# Altium schematic sheet IMU.SchDoc
size A4; SheetNumber: 1; SheetTotal: 2
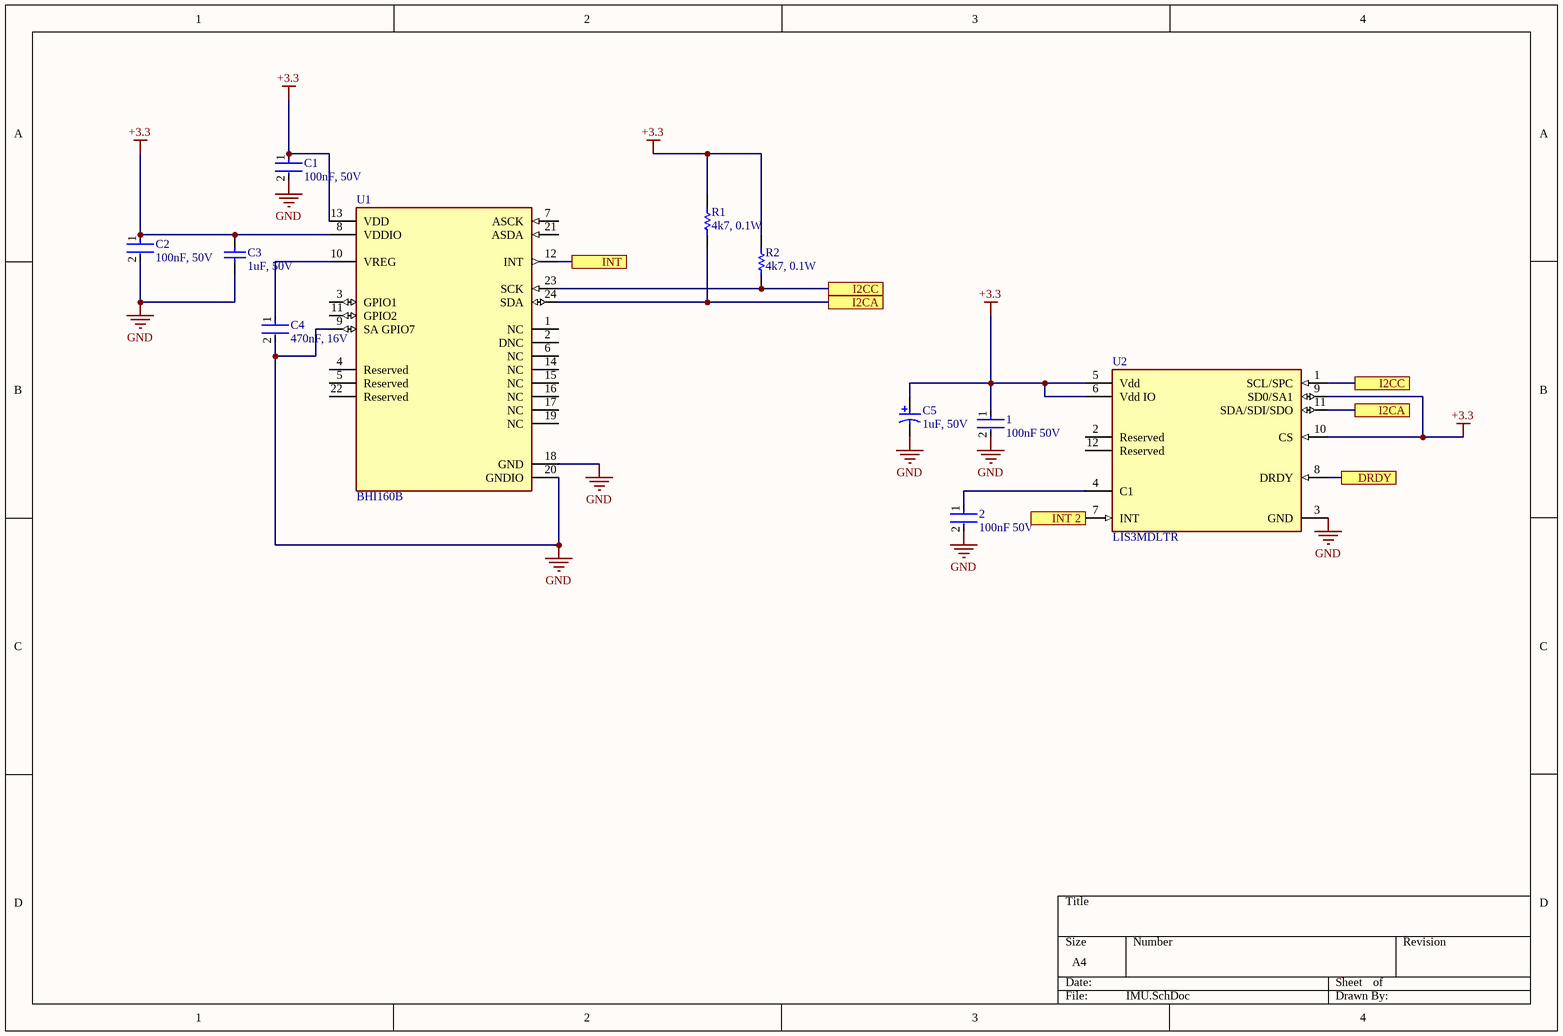
[diagram p0: IMU.SchDoc]

## Parts
1  100nF 50V  [FP-CGA3E-0_3-0_1-IPC_A]
2  100nF 50V  [FP-CGA3E-0_3-0_1-IPC_A]
C1  100nF, 50V  [FP-CGA3E-0_3-0_1-IPC_A]
C2  100nF, 50V  [FP-CGA3E-0_3-0_1-IPC_A]
C3  1uF, 50V  [CAPC1608X90X35ML10T25]
C4  470nF, 16V  [FP-C0603C-CF-MFG]
C5  1uF, 50V  [CAPPR55-200-1100X500X1200]
R1  4k7, 0.1W  [RESC1608X55X25LL10T15]
R2  4k7, 0.1W  [RESC1608X55X25LL10T15]
U1  BHI160B  [FP-BHI160B-MFG]
U2  LIS3MDLTR  [FP-VFLGA-12-8365767-MFG]

## Ports
DRDY, I2CA, I2CC, INT, INT 2

## Nets
+3.3: 1.1 C1.1 C2.1 C3.2 C5.1 R1.2 R2.2 U1.8(VDDIO) U1.13(VDD) U2.5(Vdd) U2.6(Vdd_IO) U2.9(SD0/SA1) U2.10(CS)
GND: 1.2 2.2 C1.2 C2.2 C3.1 C4.2 C5.2 U1.9(SA_GPIO7) U1.18(GND) U1.20(GNDIO) U2.3(GND)
DRDY: U2.8(DRDY) ; port DRDY
I2CA: R1.1 U1.24(SDA) U2.11(SDA/SDI/SDO) ; port I2CA
I2CC: R2.1 U1.23(SCK) U2.1(SCL/SPC) ; port I2CC
INT: U1.12(INT) ; port INT
INT 2: U2.7(INT) ; port INT 2
Net2_1: 2.1 U2.4(C1)
NetC4_1: C4.1 U1.10(VREG)

Not connected (* = marked no-connect by the designer): U1 1(NC) 2(DNC) 3(GPIO1) 4(Reserved) 5(Reserved) 6(NC) 7(ASCK) 11(GPIO2) 14(NC) 15(NC) 16(NC) 17(NC) 19(NC) 21(ASDA) 22(Reserved); U2 2(Reserved) 12(Reserved)

## Library data of the parts
1 2 C1 C2 = CMP-2000-07546-2: Cap Ceramic 100nF 50V X7R 10% Pad SMD 0603 +125°C Automotive T/R; Weight: 7.1E-05oz; Composition: Ceramic; Max Operating Temperature: 125°C; Termination: SMD/SMT; Dielectric: X7R; Length: 1.6mm; Package Quantity: 1; REACH SVHC: No SVHC; Lead Free: Lead Free; Case Code (Metric): 1608; Min Operating Temperature: -55°C; Packaging: Tape and Reel; Tolerance: 10%; Voltage Rating: 50V; Case Code (Imperial): 0603; Capacitance: 100nF; Case/Package: 0603; Voltage Rating (DC): 50V; Depth: 0.8mm; Radiation Hardening: No; Ratings: AEC-Q200; Mount: Surface Mount; Voltage: 50V; Thickness: 0.035inch; Width: 0.8mm; Height: 0.8mm
C3 = CMP-2000-05447-1: Chip Capacitor, 1 uF, +/- 10%, 50 V, -55 to 85 degC, 0603 (1608 Metric), RoHS, Tape and Reel; Manufacturer: Taiyo Yuden; Other Names: 587-2400-6; Temperature Coefficient: X5R; Online Catalog: MSeries; Catalog Drawings: xMKSeries_0603_0.8; Capacitance: 1µF; Series: M; Standard Package: 1; Package Description: 2-Pin Surface Mount Device, Body 1.6 x 0.8 mm; Ratings: -; Height - Seated (Max): -; Mounting Type: SurfaceMount,MLCC; Family: CeramicCapacitors; Size / Dimension: 0.063"Lx0.031"W(1.60mmx0.80mm); Features: -; Applications: GeneralPurpose; Lead Spacing: -; Packaging: Digi-Reel; Package Reference: 603; Thickness (Max): 0.035"(0.90mm); Category: Capacitors; Operating Temperature: -55degC~85degC; Datasheet URL: https://datasheet.ciiva.com/15922/336umk107bj105ka-t-15922611.pdf; Package / Case: 0603(1608Metric); Manufacturer URL: http://www.t-yuden.com/; Lead Style: -; Tolerance: ±10%; Voltage - Rated: 50V; Datasheet Version: Mar-13
C4 = CMP-2006-03235-2: CAP CER 0.47UF 16V X7R 0603; Manufacturer Part Number: C0603C474K4RACTU; Manufacturer: KEMET; Automotive Grade: Grade 1; Value: 0.47 μF; Tolerance: 0.1; Temperature Coefficient: 30ppm/°C; Material: Ceramic; Device Class L3: Ceramic Capacitors; ComponentLink2URL: https://api.kemet.com/component-edge/download/datasheet/C0603C100J5GACAUTO.pdf; Height: 0.87mm; ComponentLink2Description: Datasheet; Device Class L2: Capacitors; Temperature Range Low: -55°C; Temperature Range High: +125°C; RoHS: TRUE; Mouser Description: 0603 C 470nF Ceramic Multilayer Capacitor, 16 V, +125degC, X7R Dielec, +/-10%; Temperature Characteristic: X7R; Digikey Description: CAP CER 0.47UF 16V X7R 0603; Lead Free: Yes; Automotive: Yes; Octopart: https://octopart.com/c0603c474k4ractu-kemet-109683; Capacitance: 0.47 μF; Package: C0603C-CF; Voltage Rating: 16 V; Device Class L1: Passive Components; Category: Cap; Temperature: -55°C to +125°C
C5 = CMP-1665-00039-1: Aluminum Electrolytic Capacitor, 1 uF, +/- 20%, 50 V, -55 to 105 degC, 2-Pin THD, RoHS, Bulk; Channels: 2; ComponentLink1Description: Manufacturer URL; ComponentLink2Description: Datasheet; ComponentLink2URL: https://datasheet.ciiva.com/7275/94060-7275472.pdf; PackageDescription: 2-Pin Radial Lead, Dia 5 mm, Body Length 11 mm; PackageReference: CAPPR55-200-1100X500X1200; Mount: Through Hole; Radiation Hardening: No; ComponentLink1URL: http://www.panasonic.com/; Min Operating Temperature: -30 degC; Package Quantity: 150; Max Operating Temperature: 70 degC; DatasheetVersion: Mar-05; RoHSCompliant: true; Packaging: Bulk
R1 R2 = CMP-2000-06942-1: Chip Resistor, 4.7 KOhm, +/- 1%, 0.1 W, -55 to 155 degC, 0603 (1608 Metric), RoHS, Tape and Reel; Manufacturer: Yageo; Power Rating: 100mW; Temperature Coefficient: 100PPM/C; Resistance: 4.7kOhms; Voltage Rating: 50V; Package Reference: 0603; Series: RC; Datasheet Version: Rev. 7, 05/2017; Packaging: Reel; Termination Style: SMD/SMT; Datasheet URL: http://www.yageo.com/documents/recent/PYu-RC_Group_51_RoHS_L_7.pdf; Manufacturer URL: http://www.yageo.com/; Package Description: 2-Pin Surface Mount Device, Body 1.6 x 0.8 mm; Case Code - mm: 1608; Case Code - in: 0603; Mounting Technology: SurfaceMount; Operating Temperature Range: -55Cto+155C; Tolerance: 1%; Product: ThickFilmResistorsGeneralPurpose
U1 = CMP-191067-000004-1: IMU ACCEL/GYRO 3-AXIS I2C 24LGA; Manufacturer: Bosch Sensortec; Accel Resolution: 16bits; Operating Supply Current: 300-800uA; Sensor Type: Temperature,Accelerometer,Gyroscope; Accel Range: 2/4/8/16g; Gyro Sensitivity: 16.4/32.8/65.6/131.2/262.4LSB/°/s; Min Supply Voltage: 1.6V; Gyro Range: 125/250/500/1000/2000°/s; Accel Sensitivity: 2048/4096/8192/16384LSB/g; Max Supply Voltage: 3.6V; Sensor Output: I2C; Lead Free: Yes; Temperature: -40°C to +85°C; Height: 1mm; Ambient Temperature Range High: +85°C; Manufacturer Part Number: BHI160B; Temperature Range Low: -40°C; Category: IC; Octopart: https://octopart.com/bhi160b-bosch+sensortec-108216126; ComponentLink2URL: https://ae-bst.resource.bosch.com/media/_tech/media/datasheets/BST-BHI160B-DS000.pdf; RoHS: TRUE; Ambient Temperature Range Low: -40°C; Digikey Description: IMU ACCEL/GYRO 3-AXIS I2C 24LGA; Device Class L1: Sensors; Temperature Range High: +85°C; ComponentLink2Description: Datasheet; Package: 0; Device Class L2: Motion Sensors; Device Class L3: Inertial Measurement Units (IMUs); Automotive: No; Resolution: 16bits
U2 = CMP-2000-07463-2: SENSOR MR I2C/SPI 12LGA; Manufacturer: STMicroelectronics; Sensor Output: I2C,SPI; Operating Supply Current: 40-270uA; Max Supply Voltage: 3.6V; Sensing Method: Magnetic; Min Supply Voltage: 1.71V; ComponentLink2URL: https://www.st.com/resource/en/datasheet/lis3mdl.pdf; Category: IC; Manufacturer Part Number: LIS3MDLTR; Octopart: https://octopart.com/lis3mdltr-stmicroelectronics-29403125; Automotive: No; ComponentLink2Description: Datasheet; RoHS: TRUE; Device Class L3: unset; Device Class L1: Sensors; Temperature: -40°C to +85°C; Height: 1mm; Mouser Description: Board Mount Hall Effect / Magnetic Sensors Ultra Lo-Pwr Hi Perf 3-Axis 1.9-3.6V; Temperature Range High: +85°C; Lead Free: Yes; Device Class L2: Magnetic Sensors; Footprint Url: https://www.st.com/content/ccc/resource/technical/document/technical_note/73/17/9c/16/dd/96/4a/01/CD00134799.pdf/files/CD00134799.pdf/jcr:content/translations/en.CD00134799.pdf; Temperature Range Low: -40°C; Package: VFLGA-12-8365767; Digikey Description: SENSOR MR I2C/SPI 12LGA